# Altium schematic sheet motorEncoder.SchDoc
size A
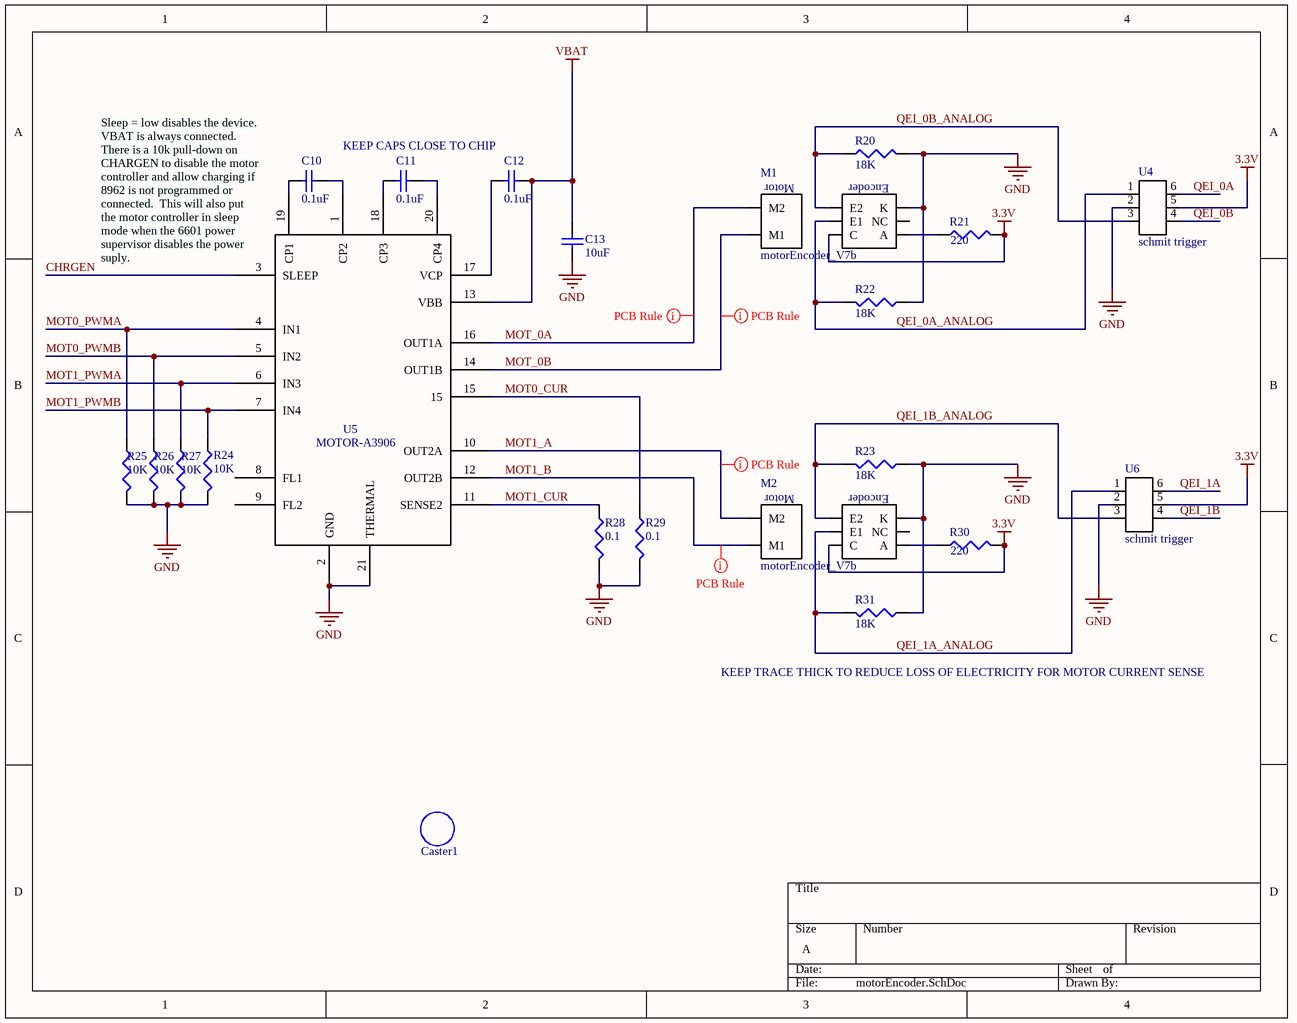
[diagram p0: motorEncoder.SchDoc]

## Parts
C10  value 0.1uF  [CAPC1005L]  (hidden comment: Cap Semi)
C11  value 0.1uF  [CAPC1005L]  (hidden comment: Cap Semi)
C12  value 0.1uF  [CAPC1005L]  (hidden comment: Cap Semi)
C13  value 10uF  [CAPC1608L]  (hidden comment: Cap Semi)
Caster1  non connect  [3/4"CASTER2]  (value not drawn)
M1  motorEncoder_V7b  [motorEncoder_V7b]
M2  motorEncoder_V7b  [motorEncoder_V7b]
R20  value 18K  [RESC1608L]
R21  value 220  [RESC1608L]
R22  value 18K  [RESC1608L]
R23  value 18K  [RESC1608L]
R24  value 10K  [RESC1608L]  (hidden comment: Res3)
R25  value 10K  [RESC1608L]  (hidden comment: Res3)
R26  value 10K  [RESC1608L]  (hidden comment: Res3)
R27  value 10K  [RESC1608L]  (hidden comment: Res3)
R28  value 0.1  [RESC1608L]  (hidden comment: Res3)
R29  value 0.1  [RESC1608L]  (hidden comment: Res3)
R30  value 220  [RESC1608L]
R31  value 18K  [RESC1608L]
U4  schmit trigger  [DCK(R-PDSO-C6)]
U5  MOTOR-A3906  [QFN-20]
U6  schmit trigger  [DCK(R-PDSO-C6)]

## Nets
3.3V: M1.C M2.C R21.2 R30.2 U4.5 U6.5
GND: C13.1 M1.K M2.K R20.2 R22.1 R23.1 R24.2 R25.2 R26.2 R27.2 R28.2 R29.2 R31.1 U4.2 U5.2(GND) U5.21(THERMAL) U6.2
VBAT: C12.1 C13.2 U5.13(VBB)
CHRGEN: U5.3(SLEEP)
MOT0_CUR: R29.1 U5.15
MOT0_PWMA: R25.1 U5.4(IN1)
MOT0_PWMB: R26.1 U5.5(IN2)
MOT1_A: M2.M2 U5.10(OUT2A)
MOT1_B: M2.M1 U5.12(OUT2B)
MOT1_CUR: R28.1 U5.11(SENSE2)
MOT1_PWMA: R27.1 U5.6(IN3)
MOT1_PWMB: R24.1 U5.7(IN4)
MOT_0A: M1.M2 U5.16(OUT1A)
MOT_0B: M1.M1 U5.14(OUT1B)
QEI_0A: U4.6
QEI_0A_ANALOG: M1.E1 R22.2 U4.1
QEI_0B: U4.4
QEI_0B_ANALOG: M1.E2 R20.1 U4.3
QEI_1A: U6.6
QEI_1A_ANALOG: M2.E1 R31.2 U6.1
QEI_1B: U6.4
QEI_1B_ANALOG: M2.E2 R23.2 U6.3
NetC10_1: C10.1 U5.19(CP1)
NetC10_2: C10.2 U5.1(CP2)
NetC11_1: C11.1 U5.18(CP3)
NetC11_2: C11.2 U5.20(CP4)
NetC12_2: C12.2 U5.17(VCP)
NetM1_A: M1.A R21.1
NetM2_A: M2.A R30.1

Not connected (* = marked no-connect by the designer): M1 NC; M2 NC; U5 8(FL1) 9(FL2)

## Layout directives
rule Width Constraint [Pref Width = 20mil    Min Width = 10mil    Max Width = 25mil]: MOT1_A, MOT1_B, MOT_0A, MOT_0B

## Notes on the sheet
- KEEP CAPS CLOSE TO CHIP
- (near U5) Sleep = low disables the device.  VBAT is always connected. There is a 10k pull-down on CHARGEN to disable the motor controller and allow charging if 8962 is not programmed or connected.  This will also put the motor controller in sleep mode when the 6601 power supervisor disables the power suply.
- KEEP TRACE THICK TO REDUCE LOSS OF ELECTRICITY FOR MOTOR CURRENT SENSE
- (in symbol motorEncoder_V7b) Motor; Encoder

## Library data of the parts
C10-C13 = Cap Semi: Capacitor (Semiconductor SIM Model); Published: 8-Jun-2000; LatestRevisionDate: 29-May-2009; LatestRevisionNote: IPC-7351 Footprint Added.; PackageReference: C1206; Publisher: Altium Limited; PackageDescription: Chip Capacitor
Caster1 = Caster 3/4in: This is just a space saver to get the caster onto the pcb
R20-R31 = Res3: Resistor; Published: 8-Jun-2000; LatestRevisionDate: 29-May-2009; LatestRevisionNote: IPC-7351 Footprint Added.; PackageReference: J1-0603; Publisher: Altium Limited; PackageDescription: Chip Resistor